# Altium schematic sheet Gastroscopy-Controller_Overview.SchDoc: Overview
size 279 x 215 mm; Date: not used; ApprovedBy: not used; CheckedBy: not used; Author: not used; DrawnBy: not used; Organization: not used; Address4: not used; SheetNumber: 2; SheetTotal: 8; Time: not used; ImagePath: not used; Application_BuildNumber: not used
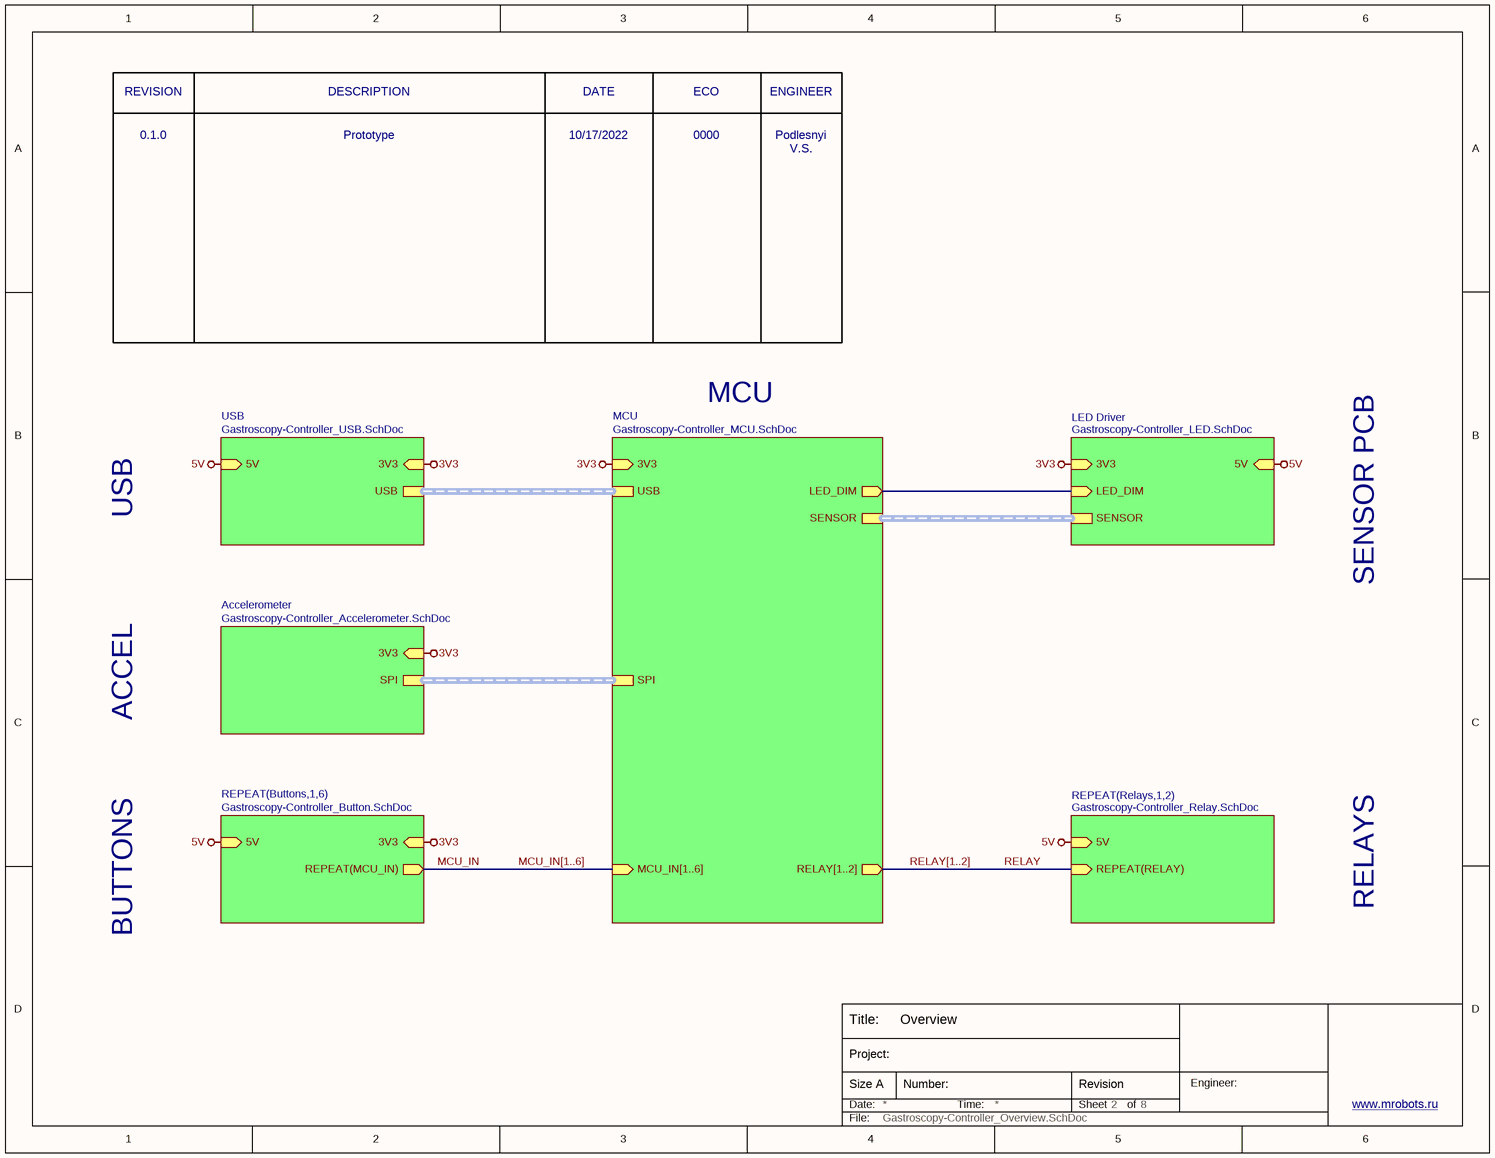
[diagram p0: Gastroscopy-Controller_Overview.SchDoc]

## Sub-sheets
Accelerometer = Gastroscopy-Controller_Accelerometer.SchDoc: 3V3 (in), SPI (harness SPI)
LED Driver = Gastroscopy-Controller_LED.SchDoc: 5V (in), LED_DIM (in), SENSOR (harness SENSOR), 3V3 (in)
MCU = Gastroscopy-Controller_MCU.SchDoc: 3V3 (in), SPI (harness SPI), USB (harness USB), MCU_IN[1..6] (in), RELAY[1..2] (out), SENSOR (harness SENSOR), LED_DIM (out)
REPEAT(Buttons,1,6) = Gastroscopy-Controller_Button.SchDoc: 3V3 (in), 5V (in), REPEAT(MCU_IN) (out)
REPEAT(Relays,1,2) = Gastroscopy-Controller_Relay.SchDoc: 5V (in), REPEAT(RELAY) (in)
USB = Gastroscopy-Controller_USB.SchDoc: 3V3 (in), USB (harness USB), 5V (in)

## Nets
3V3: sheet MCU/3V3, sheet USB/3V3, sheet Accelerometer/3V3, sheet REPEAT(Buttons,1,6)/3V3, sheet LED Driver/3V3
5V: sheet USB/5V, sheet REPEAT(Buttons,1,6)/5V, sheet REPEAT(Relays,1,2)/5V, sheet LED Driver/5V
MCU_IN: sheet REPEAT(Buttons,1,6)/REPEAT(MCU_IN)
RELAY: sheet REPEAT(Relays,1,2)/REPEAT(RELAY)
(unnamed): sheet MCU/LED_DIM, sheet LED Driver/LED_DIM

## Buses and harness runs
bus MCU_IN[1..6] = sheet MCU/MCU_IN[1..6]
bus RELAY[1..2] = sheet MCU/RELAY[1..2]
harness sheet Accelerometer/SPI = sheet MCU/SPI
harness sheet LED Driver/SENSOR = sheet MCU/SENSOR
harness sheet MCU/USB = sheet USB/USB

## Notes on the sheet
- REVISION
- DESCRIPTION
- DATE
- ECO
- ENGINEER
- 0.1.0
- Prototype
- 10/17/2022
- 0000
- Podlesnyi V.S.
- MCU
- USB
- SENSOR PCB
- ACCEL
- RELAYS
- BUTTONS
- Title:
- Date:
- Size A
- Project:
- Number:
- Time:
- Sheet
- Revision
- of
- Engineer:
- www.mrobots.ru <http://mrobots.ru/>
- File: